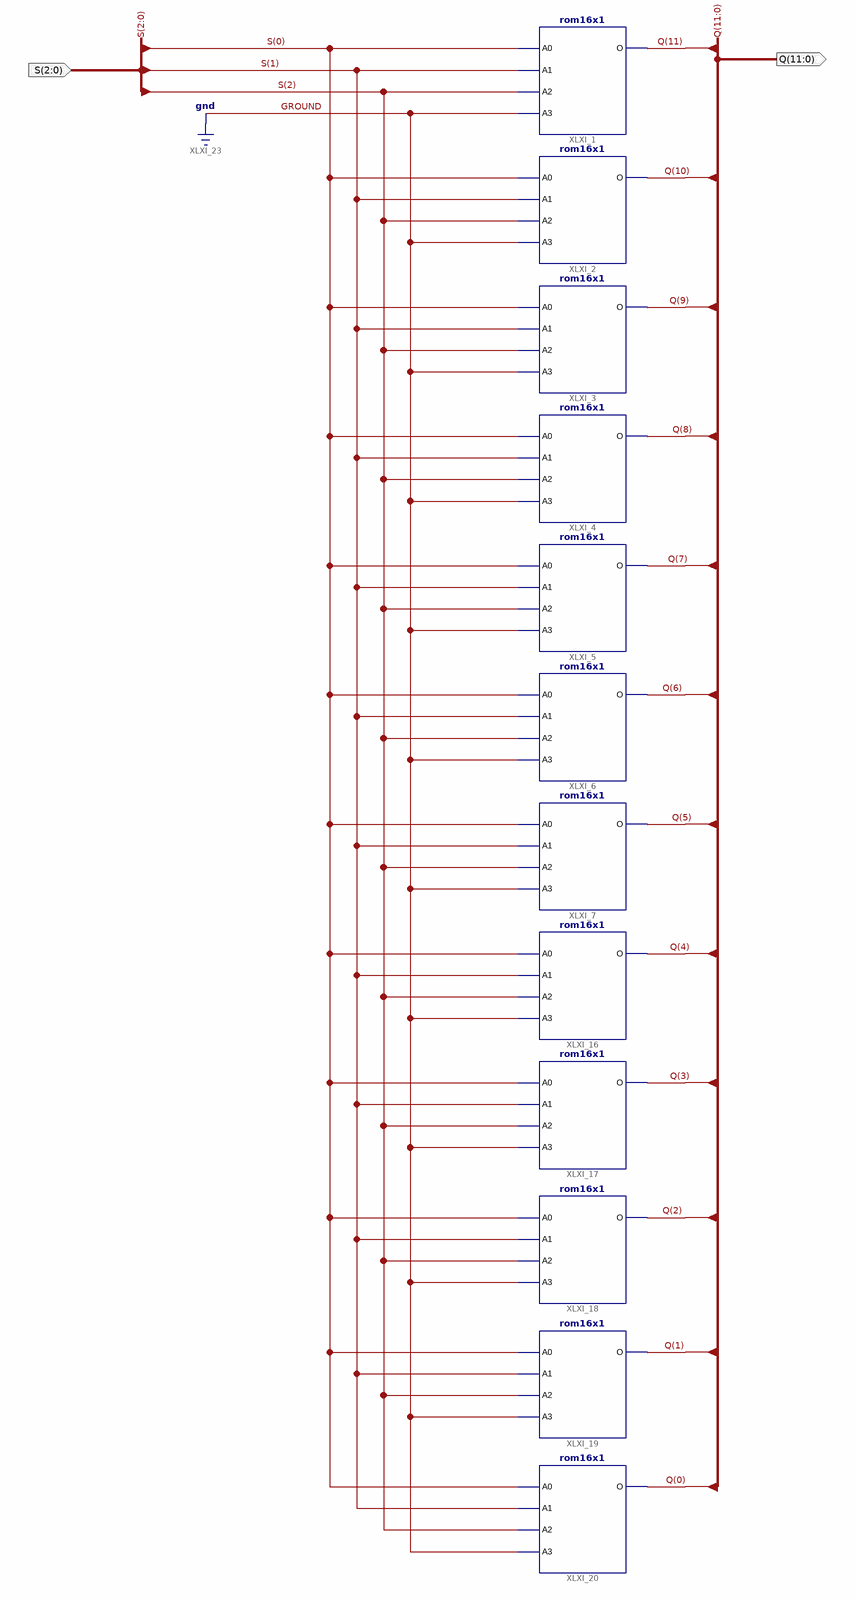
[diagram p0: schematic sheet 1]
// Xilinx ISE schematic ROMM.sch (spartan3e) as structural Verilog: 12 symbols, 2 ports
module ROMM (
  input  [2:0] S,
  output [11:0] Q
);

  rom16x1 #(.INIT("0063")) XLXI_1 (.A0(S[0]), .A1(S[1]), .A2(S[2]), .A3(1'b0), .O(Q[11]));
  rom16x1 #(.INIT("0064")) XLXI_2 (.A0(S[0]), .A1(S[1]), .A2(S[2]), .A3(1'b0), .O(Q[10]));
  rom16x1 #(.INIT("0008")) XLXI_3 (.A0(S[0]), .A1(S[1]), .A2(S[2]), .A3(1'b0), .O(Q[9]));
  rom16x1 #(.INIT("000E")) XLXI_4 (.A0(S[0]), .A1(S[1]), .A2(S[2]), .A3(1'b0), .O(Q[8]));
  rom16x1 #(.INIT("0039")) XLXI_5 (.A0(S[0]), .A1(S[1]), .A2(S[2]), .A3(1'b0), .O(Q[7]));
  rom16x1 #(.INIT("0000")) XLXI_6 (.A0(S[0]), .A1(S[1]), .A2(S[2]), .A3(1'b0), .O(Q[6]));
  rom16x1 #(.INIT("0010")) XLXI_7 (.A0(S[0]), .A1(S[1]), .A2(S[2]), .A3(1'b0), .O(Q[5]));
  rom16x1 #(.INIT("0008")) XLXI_16 (.A0(S[0]), .A1(S[1]), .A2(S[2]), .A3(1'b0), .O(Q[4]));
  rom16x1 #(.INIT("0000")) XLXI_17 (.A0(S[0]), .A1(S[1]), .A2(S[2]), .A3(1'b0), .O(Q[3]));
  rom16x1 #(.INIT("0020")) XLXI_18 (.A0(S[0]), .A1(S[1]), .A2(S[2]), .A3(1'b0), .O(Q[2]));
  rom16x1 #(.INIT("0061")) XLXI_19 (.A0(S[0]), .A1(S[1]), .A2(S[2]), .A3(1'b0), .O(Q[1]));
  rom16x1 #(.INIT("0063")) XLXI_20 (.A0(S[0]), .A1(S[1]), .A2(S[2]), .A3(1'b0), .O(Q[0]));
endmodule
